# EAGLE design 制御基板 (EAGLE 9.6.2)
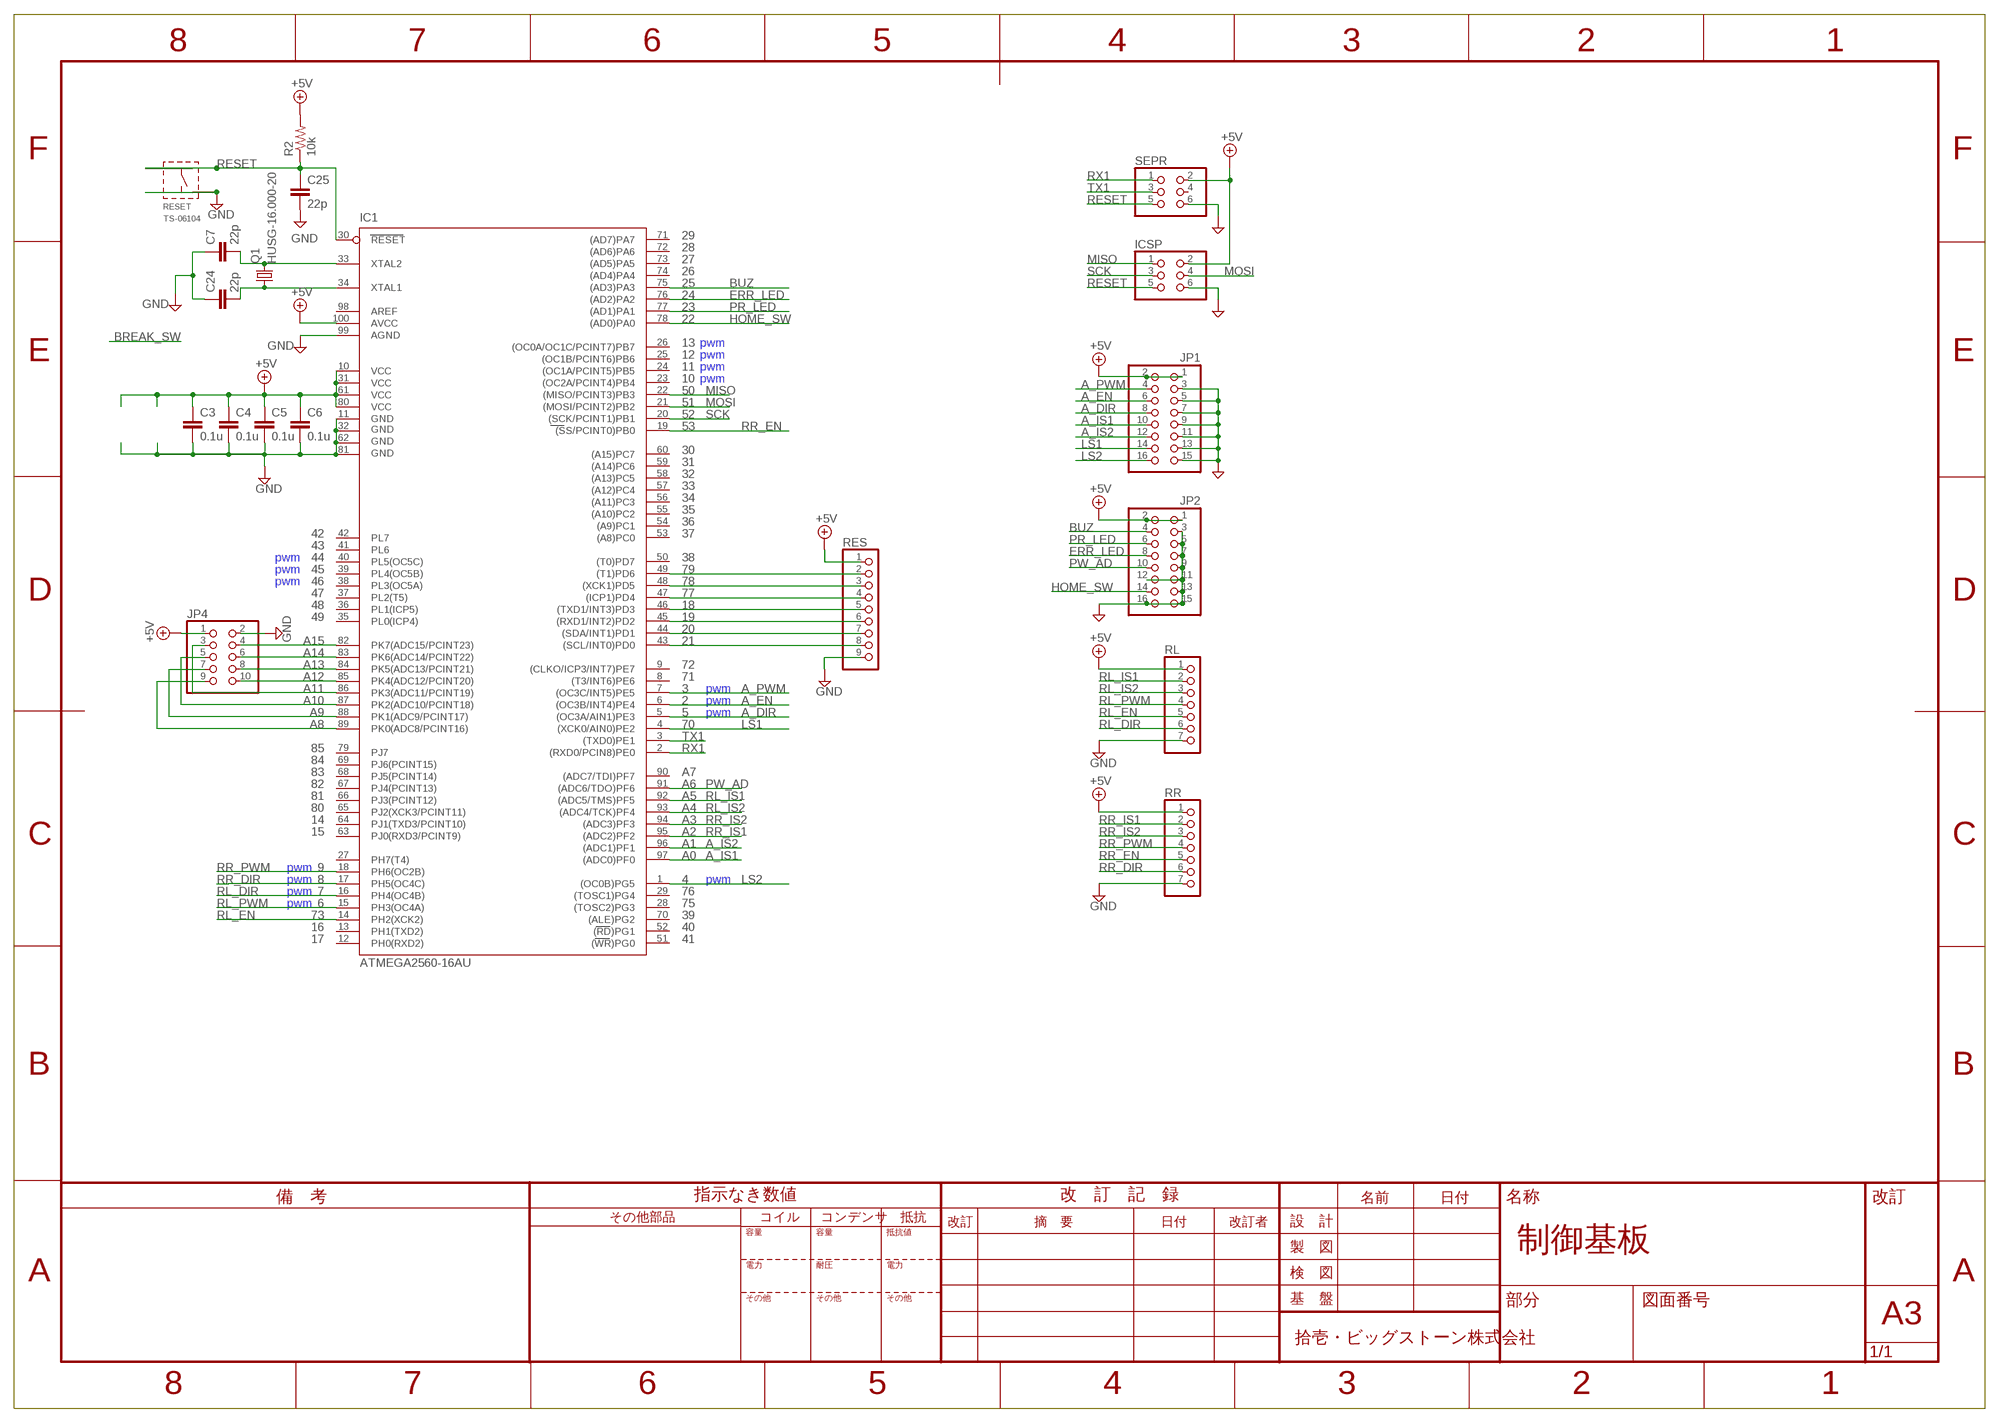
[diagram p0: schematic, sheet 1]

## Parts
C3  0.1u  C1608  [C0603]
C4  0.1u  C1608  [C0603]
C5  0.1u  C1608  [C0603]
C6  0.1u  C1608  [C0603]
C7  22p  C1608  [C0603]
C24  22p  C1608  [C0603]
C25  22p  C1608  [C0603]
IC1  ATMEGA2560-16AU  [QFP100]
ICSP  PINHD-2X3  [2X03]
JP1  PINHD-2X8  [2X08]
JP2  PINHD-2X8  [2X08]
JP4  PINHD-2X5  [2X05]
Q1  HUSG-16.000-20  [XTALRR480W50L990T368H350B]
R2  10k  R1608  [R0603]
RES  PINHD-1X9  [1X09]
RESET  TS-06104  [TS-06104]
RL  PINHD-1X7  [1X07]
RR  PINHD-1X7  [1X07]
SEPR  PINHD-2X3  [2X03]

## Nets
+5V: C3.1 C4.1 C5.1 C6.1 IC1.10(VCC) IC1.31(VCC1) IC1.61(VCC2) IC1.80(VCC3) IC1.100(AVCC) ICSP.2 JP1.1 JP1.2 JP2.1 JP2.2 JP4.1 R2.2 RES.1 RL.1 RR.1 SEPR.2
A_DIR: IC1.5((OC3A/AIN1)PE3) JP1.8
A_EN: IC1.6((OC3B/INT4)PE4) JP1.6
A_IS1: IC1.97((ADC0)PF0) JP1.10
A_IS2: IC1.96((ADC1)PF1) JP1.12
A_PWM: IC1.7((OC3C/INT5)PE5) JP1.4
BUZ: IC1.75((AD3)PA3) JP2.4
ERR_LED: IC1.76((AD2)PA2) JP2.6
GND: C3.2 C4.2 C5.2 C6.2 C7.1 C24.1 C25.2 IC1.11(GND) IC1.32(GND1) IC1.62(GND2) IC1.81(GND3) IC1.99(AGND) ICSP.6 JP1.3 JP1.5 JP1.7 JP1.9 JP1.11 JP1.13 JP1.15 JP2.3 JP2.5 JP2.7 JP2.9 JP2.11 JP2.12 JP2.13 JP2.15 JP2.16 JP4.2 RES.9 RESET.B1(T3) RESET.B2(T4) RL.7 RR.7 SEPR.6
HOME_SW: IC1.78((AD0)PA0) JP2.14
LS1: IC1.4((XCK0/AIN0)PE2) JP1.14
LS2: IC1.1((OC0B)PG5) JP1.16
MISO: IC1.22((MISO/PCINT3)PB3) ICSP.1
MOSI: IC1.21((MOSI/PCINT2)PB2) ICSP.4
N$1: IC1.43((SCL/INT0)PD0) RES.8
N$2: C24.2 IC1.34(XTAL1) Q1.1
N$3: C7.2 IC1.33(XTAL2) Q1.2
N$4: IC1.44((SDA/INT1)PD1) RES.7
N$5: IC1.45((RXD1/INT2)PD2) RES.6
N$6: IC1.46((TXD1/INT3)PD3) RES.5
N$7: IC1.47((ICP1)PD4) RES.4
N$8: IC1.48((XCK1)PD5) RES.3
N$9: IC1.49((T1)PD6) RES.2
N$10: IC1.89(PK0(ADC8/PCINT16)) JP4.9
N$11: IC1.88(PK1(ADC9/PCINT17)) JP4.7
N$12: IC1.87(PK2(ADC10/PCINT18)) JP4.5
N$13: IC1.86(PK3(ADC11/PCINT19)) JP4.3
N$14: IC1.85(PK4(ADC12/PCINT20)) JP4.10
N$15: IC1.84(PK5(ADC13/PCINT21)) JP4.8
N$16: IC1.83(PK6(ADC14/PCINT22)) JP4.6
N$17: IC1.82(PK7(ADC15/PCINT23)) JP4.4
PR_LED: IC1.77((AD1)PA1) JP2.8
PW_AD: IC1.91((ADC6/TDO)PF6) JP2.10
RESET: C25.1 IC1.30(RESET) ICSP.5 R2.1 RESET.A1(T1) RESET.A2(T2) SEPR.5
RL_DIR: IC1.16(PH4(OC4B)) RL.6
RL_EN: IC1.14(PH2(XCK2)) RL.5
RL_IS1: IC1.92((ADC5/TMS)PF5) RL.2
RL_IS2: IC1.93((ADC4/TCK)PF4) RL.3
RL_PWM: IC1.15(PH3(OC4A)) RL.4
RR_DIR: IC1.17(PH5(OC4C)) RR.6
RR_EN: IC1.19((SS/PCINT0)PB0) RR.5
RR_IS1: IC1.95((ADC2)PF2) RR.2
RR_IS2: IC1.94((ADC3)PF3) RR.3
RR_PWM: IC1.18(PH6(OC2B)) RR.4
RX1: IC1.2((RXD0/PCIN8)PE0) SEPR.1
SCK: IC1.20((SCK/PCINT1)PB1) ICSP.3
TX1: IC1.3((TXD0)PE1) SEPR.3
Unconnected: IC1.8((T3/INT6)PE6) IC1.9((CLKO/ICP3/INT7)PE7) IC1.12(PH0(RXD2)) IC1.13(PH1(TXD2)) IC1.23((OC2A/PCINT4)PB4) IC1.24((OC1A/PCINT5)PB5) IC1.25((OC1B/PCINT6)PB6) IC1.26((OC0A/OC1C/PCINT7)PB7) IC1.27(PH7(T4)) IC1.28((TOSC2)PG3) IC1.29((TOSC1)PG4) IC1.35(PL0(ICP4)) IC1.36(PL1(ICP5)) IC1.37(PL2(T5)) IC1.38(PL3(OC5A)) IC1.39(PL4(OC5B)) IC1.40(PL5(OC5C)) IC1.41(PL6) IC1.42(PL7) IC1.50((T0)PD7) IC1.51((WR)PG0) IC1.52((RD)PG1) IC1.53((A8)PC0) IC1.54((A9)PC1) IC1.55((A10)PC2) IC1.56((A11)PC3) IC1.57((A12)PC4) IC1.58((A13)PC5) IC1.59((A14)PC6) IC1.60((A15)PC7) IC1.63(PJ0(RXD3/PCINT9)) IC1.64(PJ1(TXD3/PCINT10)) IC1.65(PJ2(XCK3/PCINT11)) IC1.66(PJ3(PCINT12)) IC1.67(PJ4(PCINT13)) IC1.68(PJ5(PCINT14)) IC1.69(PJ6(PCINT15)) IC1.70((ALE)PG2) IC1.71((AD7)PA7) IC1.72((AD6)PA6) IC1.73((AD5)PA5) IC1.74((AD4)PA4) IC1.79(PJ7) IC1.90((ADC7/TDI)PF7) IC1.98(AREF) SEPR.4

## Notes on the sheet
- 29
- 28
- 27
- 26
- 25
- 24
- 23
- 22
- 13 | pwm
- 12 | pwm
- 11 | pwm
- 10 | pwm
- 50
- 51
- 52
- 53
- 30
- 31
- 32
- 33
- 34
- 35
- 36
- 42 | 37
- 43
- pwm | 44 | 38
- pwm | 45 | 79
- pwm | 46 | 78
- 47 | 77
- 48 | 18
- 49 | 19
- 20
- A15 | 21
- A14
- A13 | 72
- A12 | 71
- A11 | 3 | pwm
- A10 | 2 | pwm
- A9 | 5 | pwm
- A8 | 70
- 85
- 84
- 83 | A7
- 82 | A6
- 81 | A5
- 80 | A4
- 14 | A3
- 15 | A2
- A1
- A0
- pwm | 9
- pwm | 8 | 4 | pwm
- pwm | 7 | 76
- pwm | 6 | 75
- 73 | 39
- 16 | 40
- 17 | 41

## Library data of the parts
C3-C7 C24 C25 = RCL:C: CAPACITOR, European symbol; SPICEPREFIX: C
IC1 = atmega:ATMEGA2560: [I-16567] ＡＶＲマイコン ＡＴＭＥＧＡ２５６０
ICSP SEPR = pinhead:PINHD-2X3: PIN HEADER
JP1 JP2 = pinhead:PINHD-2X8: PIN HEADER
JP4 = pinhead:PINHD-2X5: PIN HEADER
Q1 = 水晶振動子:HUSG-16.000-20: クリスタル（水晶発振子） １６ＭＨｚ [HUSG-16.000-20] 通販コード P-08671 発売日 2014/11/05 メーカーカテゴリ Mercury Electronic Industrial co., Ltd. </catalog/goods/search.aspx?maker=mercury&style=T&search.x=true> 小型のHC-49/S型パッケージのクリスタル(水晶発振子・水晶振動子)です。クリスタル(石英)の圧電効果を利用し安定した周波数源として利用されています。 ■主な仕様 ・シリーズ：HUSG ・周波数：16MHz ・切断方位(カット)：AT ・オーバートーン次数：Fundamental ・負荷容量：20pF ・ドライブレベル：100μW ・等価直列抵抗(ESR)：40Ω ・周波数許容偏差：±30ppm ・周波数安定性：±30ppm ・周波数経年変化：~&#1初年度) ・実装タイプ：スルーホール ・寸法：10.7mm×4.3mm×3.5mm(リード含まず) ・高さ：3.5mm ・使用温度範囲：-10~60℃ [P-08671] クリスタル（水晶発振子） １６ＭＨｚ 1個 ￥30（税込）
R2 = RCL:R: RESISTOR, American symbol; SPICEPREFIX: R
RES = pinhead:PINHD-1X9: PIN HEADER
RESET = タクトスイッチ:TS-06104: 表面実装用タクトスイッチ ＴＳ－０６１０４ [TS-06104] 通販コード P-15969 発売日 2020/12/16 メーカーカテゴリ XIAMEN JINBEILI ELECTRONICS CO.,LTD </catalog/goods/search.aspx?maker=jinbeili&style=T&search.x=true> 表面実装タイプのタクトスイッチです。こちらはお客様からご要望を頂き販売を開始いたしました。各種部品、半導体、機構部品等のご要望をお待ちしております。商品リクエスト入力フォーム </catalog/c/cparts99> ■主な仕様 ・種別：タクトスイッチ ・表記：A接点 ・回路数：1回路 ・接点：1接点 ・定格開閉電圧：12VDC ・定格開閉電流：50mA ・接触抵抗：2Ω以下 ・動作：モーメンタリ ・取付タイプ：基板取付 ・電気的接続：表面実装 ・色：黒 ・ピン数：4 TS-06104 PDFデータシート </download/ds/jinbeili/TS-06104.pdf> タクトスイッチ各種 </catalog/c/ctactsw> トグルスイッチ各種 </catalog/c/ctoggle> スイッチ各種 </catalog/c/csw> 関連商品≫組立ｷｯﾄ </catalog/c/ckit_dT> / ﾌﾞﾚｯﾄﾞﾎﾞｰﾄﾞ </catalog/c/cbread> / ﾏｲｺﾝ </catalog/c/cmicon_dT>(PIC </catalog/c/cpicr> H8 </catalog/c/ch8> RX </catalog/c/crx>) / USB </catalog/c/cusb> / TR </catalog/c/ctr>(TO-220 </catalog/c/cto-220> TO-92 </catalog/c/cto-92> TO-3P </catalog/c/cto-3p> SMD </catalog/c/cctr>) / FET </catalog/c/cfet>(Nch </catalog/c/c2sk> Pch </catalog/c/c2sj> SMD </catalog/c/ccfet> TO-252 </catalog/goods/search.aspx?keyword=fet+dpak&goods=i&search=x> SOT-23 </catalog/goods/search.aspx?keyword=sot23&goods=i&name=fet&search=x>) / ﾀﾞｲｵｰﾄﾞ </catalog/c/cdiode>(整流 </catalog/c/csilicon> ｼｮｯﾄｷｰ </catalog/c/cschottky> ﾌﾞﾘｯｼﾞ </catalog/c/cbridge> SMD </catalog/c/csmddiode> CRD </catalog/c/ccrd> ﾂｪﾅ </catalog/c/czd>) / 抵抗 </catalog/c/cregister>(ｶｰﾎﾞﾝ </catalog/goods/search.aspx?keyword=%83J%81%5B%83%7B%83%93&search=x> 金皮 </catalog/goods/search.aspx?keyword=%8B%E0%91%AE%94%E7%96%8C&image=%8C%9F%8D%F5&search=x> 電力 </catalog/c/cregi7> SMD </catalog/c/cchipreg>) / ｲﾝﾀﾞｸﾀ </catalog/c/ccoil> / ｺﾝﾃﾞﾝｻ </catalog/c/ccap>(電解 </catalog/c/cchemicon> 積ｾﾗ </catalog/c/ccap3> ﾁｯﾌﾟ積ｾﾗ </catalog/c/ccap8> 電気二重層 </catalog/c/ccap2>) / LED </catalog/c/cled_dT>(3mm </catalog/c/c3mm> 5mm </catalog/c/c5mm> 角型 </catalog/c/csuperflx> SMD </catalog/c/csmdled> 点滅 </catalog/c/cblanking> ﾊﾟﾜｰ </catalog/c/cpwrled> ﾊﾞｰ </catalog/c/cbar> ７ｾｸﾞ </catalog/c/ca7seg>) / LCD </catalog/c/cclcd> / ACｱﾀﾞﾌﾟﾀ </catalog/c/cswpower> / VR </catalog/c/cvr> / SW </catalog/c/csw>(ﾀｸﾄ </catalog/c/ctactsw> ﾄｸﾞﾙ </catalog/c/ctoggle> 押ﾎﾞﾀﾝ </catalog/c/cpushsw> 自照式 </catalog/c/csw8> ﾛｰﾀﾘ </catalog/c/crotarysw> ｽﾗｲﾄﾞ </catalog/c/cslidesw>) / ｹｰｽ </catalog/c/ccase> / 基板 </catalog/c/cboard>(ﾕﾆﾊﾞｰｻﾙ </catalog/c/cuboard> SMD </catalog/c/csuboard> DIP化 </catalog/c/cwithbrd> 変換 </catalog/c/ccpcb> 電力 </catalog/c/cboard11> ｱﾙﾐ </catalog/c/calumi>) / ﾋﾟﾝﾍｯﾀﾞ </catalog/c/cheader> / ﾋﾟﾝｿｹｯﾄ </catalog/c/cframe> / 線材 </catalog/c/csen4> / ﾀｰﾐﾅﾙ </catalog/c/cterminal> / ｺﾈｸﾀ </catalog/c/cconn> / 電池ｹｰｽ </catalog/c/cbattca> / 電池一般 </catalog/c/cbatt_dT>(鉛蓄電池 </catalog/c/cbatpb> ｱﾙｶﾘ </catalog/e/ealkarine> ﾎﾞﾀﾝ･ｺｲﾝ </catalog/c/cbatcoin>) / 放熱器 </catalog/c/cheat> / ﾊﾟｰﾂ </catalog/c/cparts_dT> [P-15969] 表面実装用タクトスイッチ ＴＳ－０６１０４ </catalog/faq/faq.aspx#10020> 1個 ￥20（税込）
RL RR = pinhead:PINHD-1X7: PIN HEADER

## Net classes
1 power: clearance 0.381 mm

## Board
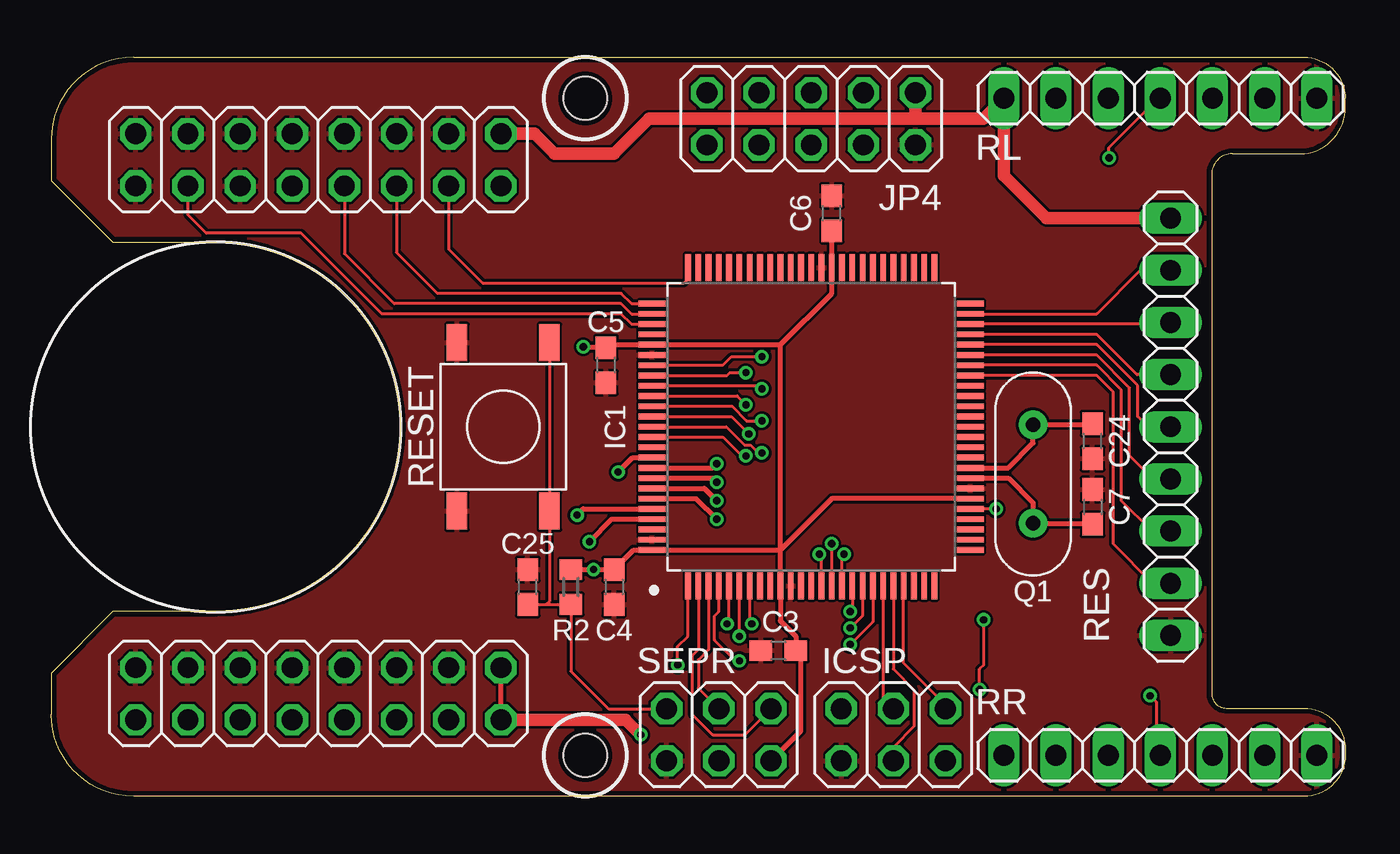
[diagram p1: board, top side]
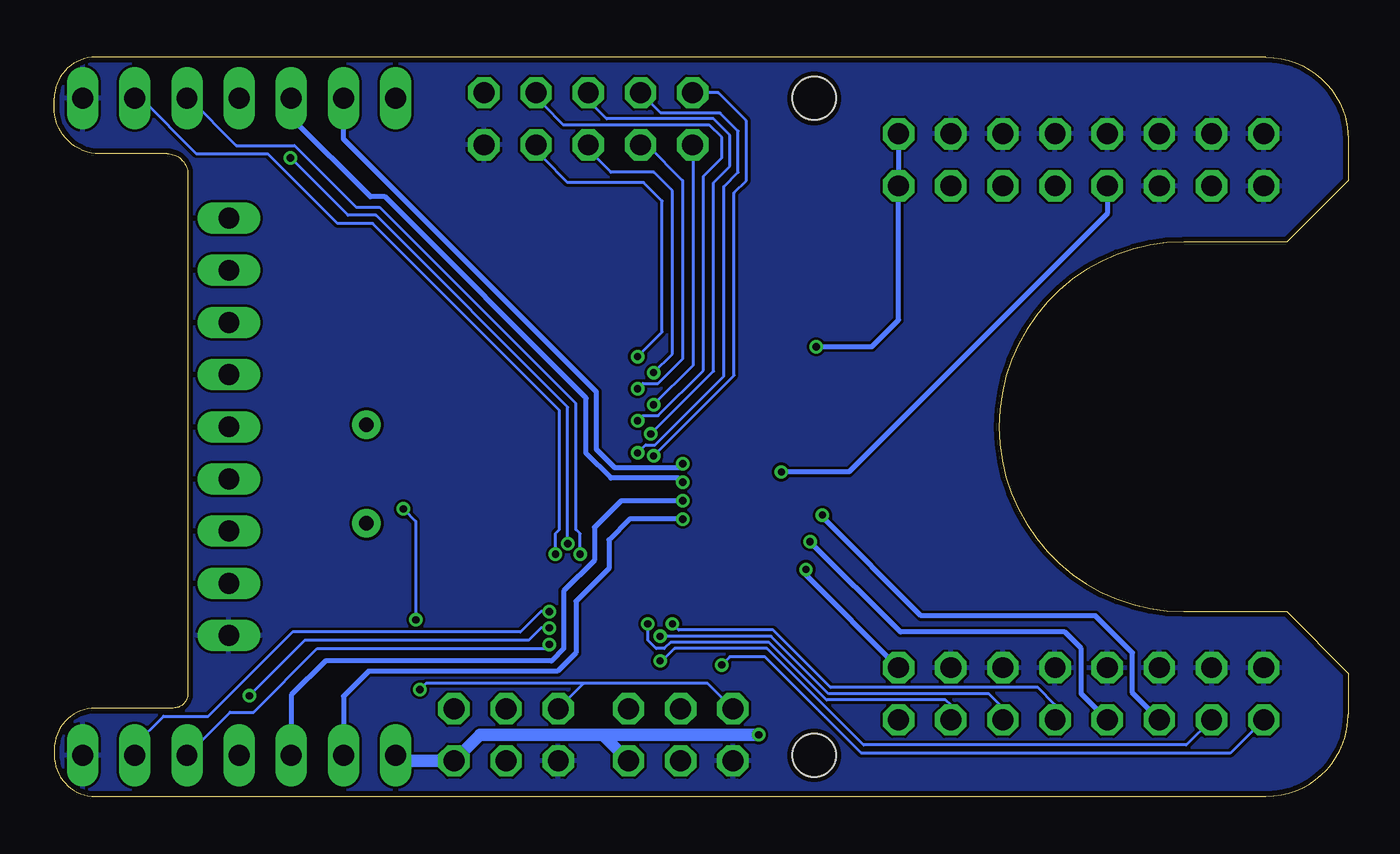
[diagram p2: board, bottom side, seen from below]

Size 63.01 x 36 mm. Coordinates in mm from the lower left corner, seen from the top.
Outline: 61,0 4,0 arc-90 0,4 0,6 3,9 8,9 arc90 17,18 arc90 8,27 3,27 0,30 0,32 arc-90 4,36 61,36 arc-90 63,34 63,33.8 arc-90 61,31.3 57.5,31.3 arc90 56.5,30.3 56.5,5 arc90 57.2,4.3 61,4.3 arc-90 63,2.3 63,2 arc-90 61,0
Copper layers (1*16): Top 0.035mm / dielectric 1.53mm / Bottom 0.035mm
Design rules "JLPCB_2layer *": minimum track width 5mil, minimum drill 0.2mm, track to track 5mil, track to pad 5mil, pad to pad 5mil, via to via 5mil, smd to smd 0mil, copper to edge 0.25mm, drill to drill 0.25mm, minimum pad ring 6mil, minimum via ring 6mil, stop-mask expansion 0mil, vias tented up to drill 0.6mm, thermal gap 5mil
Holes 2.1 mm at 26,2 26,34

### Footprints (pad centres in the part's own frame; a part is rotated, then mirrored left to right if it is on the bottom)
C0603 = smd 1.1 x 1: 1 -0.85,0; 2 0.85,0
QFP100 = smd 1.312 x 0.28: 1 -7.75,6; 2 -7.75,5.5; 3 -7.75,5; 4 -7.75,4.5; 5 -7.75,4; 6 -7.75,3.5; 7 -7.75,3; 8 -7.75,2.5; 9 -7.75,2; 10 -7.75,1.5; 11 -7.75,1; 12 -7.75,0.5; 13 -7.75,0; 14 -7.75,-0.5; 15 -7.75,-1; 16 -7.75,-1.5; 17 -7.75,-2; 18 -7.75,-2.5; 19 -7.75,-3; 20 -7.75,-3.5; 21 -7.75,-4; 22 -7.75,-4.5; 23 -7.75,-5; 24 -7.75,-5.5; 25 -7.75,-6; 51 7.75,-6; 52 7.75,-5.5; 53 7.75,-5; 54 7.75,-4.5; 55 7.75,-4; 56 7.75,-3.5; 57 7.75,-3; 58 7.75,-2.5; 59 7.75,-2; 60 7.75,-1.5; 61 7.75,-1; 62 7.75,-0.5; 63 7.75,0; 64 7.75,0.5; 65 7.75,1; 66 7.75,1.5; 67 7.75,2; 68 7.75,2.5; 69 7.75,3; 70 7.75,3.5; 71 7.75,4; 72 7.75,4.5; 73 7.75,5; 74 7.75,5.5; 75 7.75,6 | smd 0.28 x 1.312: 26 -6,-7.75; 27 -5.5,-7.75; 28 -5,-7.75; 29 -4.5,-7.75; 30 -4,-7.75; 31 -3.5,-7.75; 32 -3,-7.75; 33 -2.5,-7.75; 34 -2,-7.75; 35 -1.5,-7.75; 36 -1,-7.75; 37 -0.5,-7.75; 38 0,-7.75; 39 0.5,-7.75; 40 1,-7.75; 41 1.5,-7.75; 42 2,-7.75; 43 2.5,-7.75; 44 3,-7.75; 45 3.5,-7.75; 46 4,-7.75; 47 4.5,-7.75; 48 5,-7.75; 49 5.5,-7.75; 50 6,-7.75; 76 6,7.75; 77 5.5,7.75; 78 5,7.75; 79 4.5,7.75; 80 4,7.75; 81 3.5,7.75; 82 3,7.75; 83 2.5,7.75; 84 2,7.75; 85 1.5,7.75; 86 1,7.75; 87 0.5,7.75; 88 0,7.75; 89 -0.5,7.75; 90 -1,7.75; 91 -1.5,7.75; 92 -2,7.75; 93 -2.5,7.75; 94 -3,7.75; 95 -3.5,7.75; 96 -4,7.75; 97 -4.5,7.75; 98 -5,7.75; 99 -5.5,7.75; 100 -6,7.75
2X03 = drill 1.016 octagon: 1 -2.54,-1.27; 2 -2.54,1.27; 3 0,-1.27; 4 0,1.27; 5 2.54,-1.27; 6 2.54,1.27
2X08 = drill 1.016 octagon: 1 -8.89,-1.27; 2 -8.89,1.27; 3 -6.35,-1.27; 4 -6.35,1.27; 5 -3.81,-1.27; 6 -3.81,1.27; 7 -1.27,-1.27; 8 -1.27,1.27; 9 1.27,-1.27; 10 1.27,1.27; 11 3.81,-1.27; 12 3.81,1.27; 13 6.35,-1.27; 14 6.35,1.27; 15 8.89,-1.27; 16 8.89,1.27
2X05 = drill 1.016 octagon: 1 -5.08,-1.27; 2 -5.08,1.27; 3 -2.54,-1.27; 4 -2.54,1.27; 5 0,-1.27; 6 0,1.27; 7 2.54,-1.27; 8 2.54,1.27; 9 5.08,-1.27; 10 5.08,1.27
XTALRR480W50L990T368H350B = drill 0.7 pad 1.4: 1 -2.4,0; 2 2.4,0
R0603 = smd 1 x 1.1: 1 -0.85,0; 2 0.85,0
1X09 = drill 1.016 long: 1 -10.16,0; 2 -7.62,0; 3 -5.08,0; 4 -2.54,0; 5 0,0; 6 2.54,0; 7 5.08,0; 8 7.62,0; 9 10.16,0
TS-06104 = smd 1.8 x 1: A1 -4.1,2.25; A2 4.1,2.25; B1 -4.1,-2.25; B2 4.1,-2.25
1X07 = drill 1.016 long: 1 -7.62,0; 2 -5.08,0; 3 -2.54,0; 4 0,0; 5 2.54,0; 6 5.08,0; 7 7.62,0

### Placement (x,y rotation side)
C3  35.4,7.1 180 top
C4  27.4,10.2 270 top
C5  27,21 270 top
C6  38,28.4 90 top
C7  50.7,14.1 270 top
C24  50.7,17.3 90 top
C25  23.2,10.2 90 top
IC1  37,18 90 top
ICSP  41,3 180 top
JP1  13,5 180 top
JP2  13,31 180 top
JP4  37,33 180 top
Q1  47.8,15.7 270 top
R2  25.3,10.2 90 top
RES  54.5,18 270 top
RESET  22,18 270 top
RL  54,34 0 top
RR  54,2 0 top
SEPR  32.5,3 180 top

### Tracks (layer width: path | path; a pad name or v marks a point on that pad's centre or on a via)
+5V  (via drill 0.35)
  Top 0.254: 35.5,22 IC1.80 27,22 C5.1 25.95,21.85 v25.9,21.9 | 35.5,22 38,24.5 IC1.61 C6.1 | IC1.31 38,14.5 35.5,12 | 35.5,12 IC1.10 35.5,8.55 36.25,7.8 C3.1 36.5,6.85 36.5,3.19 SEPR.2 | 35.5,12 IC1.100 28.35,12 C4.1 v26.4,11.05 R2.2 | 35.5,12 35.5,22 | JP1.2 JP1.1
  Top 0.6: JP4.1 42.08,33 | 42.08,33.08 42,33
  Top 0.61: JP2.1 23.53,32.27 24.5,31.3 27.4,31.3 29.1,33 42,33 | 42.08,33 45.38,33 RL.1 46.38,30.22 48.44,28.16 RES.1 | JP1.2 27.97,3.73 v28.7,3
  Bottom 0.254: SEPR.2 36.21,2.9 | JP1.1 26.4,10.78 v26.4,11.05 | v25.9,21.9 23.2,21.9 21.89,23.21 JP2.2 JP2.1
  Bottom 0.61: RR.1 46.11,1.73 ICSP.2 42.27,3 36.31,3 | SEPR.2 36.31,3 | v28.7,3 36.31,3
A_DIR  (via drill 0.35)
  Top 0.15: v32.9,8.4 33,8.5 IC1.5
  Bottom 0.15: JP1.8 14.27,4.47 15.1,5.3 25.2,5.3 28,8.1 32.6,8.1 v32.9,8.4
A_EN  (via drill 0.35)
  Top 0.15: v33.5,7.8 IC1.6
  Bottom 0.15: JP1.6 16.81,4.31 17.5,5 25.3,5 28.1,7.8 v33.5,7.8
A_IS1  (via drill 0.35)
  Top 0.254: v26.2,12.4 27.3,13.5 IC1.97
  Bottom 0.254: JP1.10 13,5 13,7.2 13.8,8 21.8,8 v26.2,12.4
A_IS2  (via drill 0.35)
  Top 0.254: v25.6,13.7 25.9,14 IC1.96
  Bottom 0.254: JP1.12 10.5,5.04 10.5,7 12.3,8.8 20.8,8.8 25.6,13.6 v25.6,13.7
A_PWM  (via drill 0.35)
  Top 0.15: IC1.7 34,8.5 v34.1,8.4
  Bottom 0.15: JP1.4 19.35,4.45 19.6,4.7 25.4,4.7 28.2,7.5 33,7.5 33.3,7.2 33.7,7.2 34.1,7.6 v34.1,8.4
BUZ
  Top 0.15: JP2.4 19.35,26.65 21,25 30.8,25 31,25.2 IC1.75
ERR_LED
  Top 0.15: JP2.6 16.81,26.49 18.8,24.5 27.75,24.5 28.25,24 IC1.76
GND
  pour Top: 0,0 0,36 63,36 63,0
  pour Bottom: 63,0 63,36 0,36 0,0
HOME_SW
  Top 0.15: JP2.14 6.65,28.33 7.55,27.43 12.17,27.43 16.1,23.5 27.75,23.5 28.25,23 IC1.78
LS1  (via drill 0.35)
  Top 0.15: v33.5,6.6 33.3,6.6 32.3,7.6 32.3,8.8 32.5,9 IC1.4
  Bottom 0.15: JP1.14 7.88,2.5 23.6,2.5 28.3,7.2 32.8,7.2 33.4,6.6 v33.5,6.6
LS2  (via drill 0.35)
  Top 0.15: v30.5,6.4 30.5,7.3 31,7.8 IC1.1
  Bottom 0.15: JP1.16 5.74,2.1 23.7,2.1 28.4,6.8 30.1,6.8 v30.5,6.4
MISO
  Top 0.15: ICSP.1 43.54,4.46 41.5,6.5 IC1.22
MOSI
  Top 0.15: IC1.21 41,6.2 42,5.2 42,3.4 41,2.4 ICSP.4
N$1
  Top 0.15: IC1.43 50.9,20.5 51.7,19.7 51.7,12.3 53.62,10.38 RES.8
N$2
  Top 0.254: C24.2 50.65,18.1 Q1.1 47.8,17.2 46.6,16 IC1.34
N$3
  Top 0.254: C7.2 50.65,13.3 Q1.2 47.8,14.3 46.6,15.5 IC1.33
N$4
  Top 0.15: IC1.44 50.9,21 52.1,19.8 52.1,14.4 53.58,12.92 RES.7
N$5
  Top 0.15: IC1.45 50.9,21.5 52.5,19.9 52.5,16.6 53.64,15.46 RES.6
N$6
  Top 0.15: IC1.46 50.9,22 52.9,20 52.9,18.5 53.4,18 RES.5
N$7
  Top 0.15: IC1.47 50.9,22.5 52.86,20.54 RES.4
N$8
  Top 0.15: RES.3 54.42,23 IC1.48
N$9
  Top 0.15: IC1.49 50.9,23.5 53.02,25.62 RES.2
N$10  (via drill 0.35)
  Top 0.15: v33.82,16.58 33.62,16.58 32.7,17.5 IC1.89
  Bottom 0.15: v33.82,16.58 29.9,20.5 29.9,29.4 29.3,30 29.3,32.9 30.67,34.27 JP4.9
N$11  (via drill 0.35)
  Top 0.15: v34.6,16.73 34.42,16.73 34.04,17.11 33.75,17.11 32.87,18 IC1.88
  Bottom 0.15: v34.6,16.73 34.2,17.12 33.74,17.12 30.4,20.47 30.4,29.7 29.7,30.4 29.7,32.4 30.58,33.28 33.47,33.28 JP4.7
N$12  (via drill 0.35)
  Top 0.15: v33.96,17.65 33.11,18.5 IC1.87
  Bottom 0.15: v33.96,17.65 30.9,20.71 30.9,29.9 30.1,30.7 30.1,32.2 30.9,33 36.1,33 36.7,33.6 36.7,34.24 36.97,34.24 JP4.5
N$13  (via drill 0.35)
  Top 0.15: v34.6,18.29 33.85,18.29 33.14,19 IC1.86
  Bottom 0.15: v34.6,18.29 34.35,18.54 33.6,18.54 31.4,20.74 31.4,30.2 30.5,31.1 30.5,32.1 31.1,32.7 38.2,32.7 39.21,33.71 39.21,33.94 JP4.3
N$14  (via drill 0.35)
  Top 0.15: v33.82,19.07 33.39,19.5 IC1.85
  Bottom 0.127: JP4.10 31.92,31.44 31.9,31.42
  Bottom 0.15: v33.82,19.07 31.9,20.99 31.9,31.42
N$15  (via drill 0.35)
  Top 0.15: v34.6,19.86 34.45,20 IC1.84
  Bottom 0.15: v34.6,19.86 34.35,20.11 33.6,20.11 32.4,21.31 32.4,30 34.13,31.73 JP4.8
N$16  (via drill 0.35)
  Top 0.15: v33.82,20.64 33.04,20.64 32.91,20.5 IC1.83
  Bottom 0.15: v33.82,20.64 32.9,21.55 32.9,29.5 33.8,30.4 35.9,30.4 36.67,31.17 36.67,31.4 JP4.6
N$17  (via drill 0.35)
  Top 0.15: v34.6,21.42 33.12,21.42 32.7,21 IC1.82
  Bottom 0.15: v34.6,21.42 33.4,22.62 33.4,29 34.3,29.9 38,29.9 39.21,31.11 39.21,31.4 JP4.4
PR_LED
  Top 0.15: JP2.8 14.27,26.43 16.7,24 27.75,24 28.25,23.5 IC1.77
PW_AD  (via drill 0.35)
  Top 0.254: v27.6,15.8 28.3,16.5 IC1.91
  Bottom 0.254: JP2.10 11.73,28.37 24.3,15.8 v27.6,15.8
RESET  (via drill 0.35)
  Top 0.15: C25.1 24.1,9.35 | 24.1,9.35 R2.1 25.3,6.1 27.13,4.27 SEPR.5 | 24.1,9.35 24.25,9.5 RESET.A2 RESET.A1 | v45.2,5.2 45.2,6.2 45.4,6.4 v45.4,8.6 | v46,14 IC1.30
  Bottom 0.15: SEPR.5 31.19,5.5 37.23,5.5 | 37.23,5.5 ICSP.5 | 37.23,5.5 44.9,5.5 v45.2,5.2 | v46,14 45.4,13.4 v45.4,8.6
RL_DIR  (via drill 0.35)
  Top 0.15: IC1.16 38.5,11.7 v38.6,11.8
  Bottom 0.15: v38.6,11.8 38.6,12.8 38.4,13 38.4,18.8 47.5,27.9 49.2,27.9 52.6,31.3 56.08,31.3 58.78,34 RL.6
RL_EN  (via drill 0.35)
  Top 0.15: IC1.14 37.5,11.69 v37.4,11.8
  Bottom 0.15: v37.4,11.8 37.4,12.8 37.6,13 37.6,19.12 47.17,28.69 48.29,28.69 51.3,31.7 54.14,31.7 56.44,34 RL.5
RL_IS1  (via drill 0.35)
  Top 0.254: IC1.92 32.2,16 v32.4,16.2
  Bottom 0.254: v32.4,16.2 32.6,16 35.7,16 36.6,16.9 36.6,19.7 48.92,32.02 RL.2
RL_IS2  (via drill 0.35)
  Top 0.254: IC1.93 32.2,15.5 v32.4,15.3
  Bottom 0.254: v32.4,15.3 32.6,15.5 35.9,15.5 37.1,16.7 37.1,19.4 46.9,29.2 47.6,29.2 51.46,33.06 RL.3
RL_PWM  (via drill 0.35)
  Top 0.15: IC1.15 v38,12.3 | v51.5,31.1 51.5,31.6 54,34.1 RL.4
  Bottom 0.15: v38,12.3 38,18.96 47.34,28.3 48.7,28.3 v51.5,31.1
RR_DIR  (via drill 0.35)
  Top 0.15: IC1.17 39,9.1 v38.9,9
  Bottom 0.15: v38.9,9 39.3,9 40.3,8 51.4,8 55.5,3.9 57.68,3.9 59.08,2.5 RR.6
RR_EN  (via drill 0.35)
  Top 0.15: IC1.19 40,8.5 v38.9,7.4
  Bottom 0.15: v38.9,7.4 39.1,7.2 50.2,7.2 53.3,4.1 54.44,4.1 RR.5
RR_IS1  (via drill 0.35)
  Top 0.254: IC1.95 31.4,14.5 v32.4,13.5
  Bottom 0.254: v32.4,13.5 35,13.5 36,12.5 36,11.1 37.6,9.5 37.6,7 38.5,6.1 47.7,6.1 48.92,4.88 RR.2
RR_IS2  (via drill 0.35)
  Top 0.254: IC1.94 31.8,15 v32.4,14.4
  Bottom 0.254: v32.4,14.4 35.4,14.4 36.7,13.1 36.7,11.5 38.2,10 38.2,7.2 38.8,6.6 49.8,6.6 51.46,4.94 RR.3
RR_PWM  (via drill 0.35)
  Top 0.15: IC1.18 39.5,8.8 v38.9,8.2 | v53.5,4.9 53.8,4.6 53.8,2.2 RR.4
  Bottom 0.15: v38.9,8.2 39.3,8.2 39.9,7.6 50.8,7.6 v53.5,4.9
RX1
  Top 0.15: IC1.2 31.5,7.15 31.2,6.85 31.2,4 32.2,3 33.77,3 SEPR.1
SCK
  Top 0.15: IC1.20 40.5,4.77 ICSP.3
TX1
  Top 0.15: IC1.3 32,7.15 31.5,6.65 31.5,5.27 SEPR.3

### Text on the board
_tNames: RL | JP4 | C6 | C5 | RESET | IC1 | C24 | C7 | C25 | Q1 | R2 | C4 | C3 | RES | SEPR | ICSP | RR